# Altium schematic sheet 80_SignalInput.SchDoc
size A3; SheetNumber: 9; SheetTotal: 12
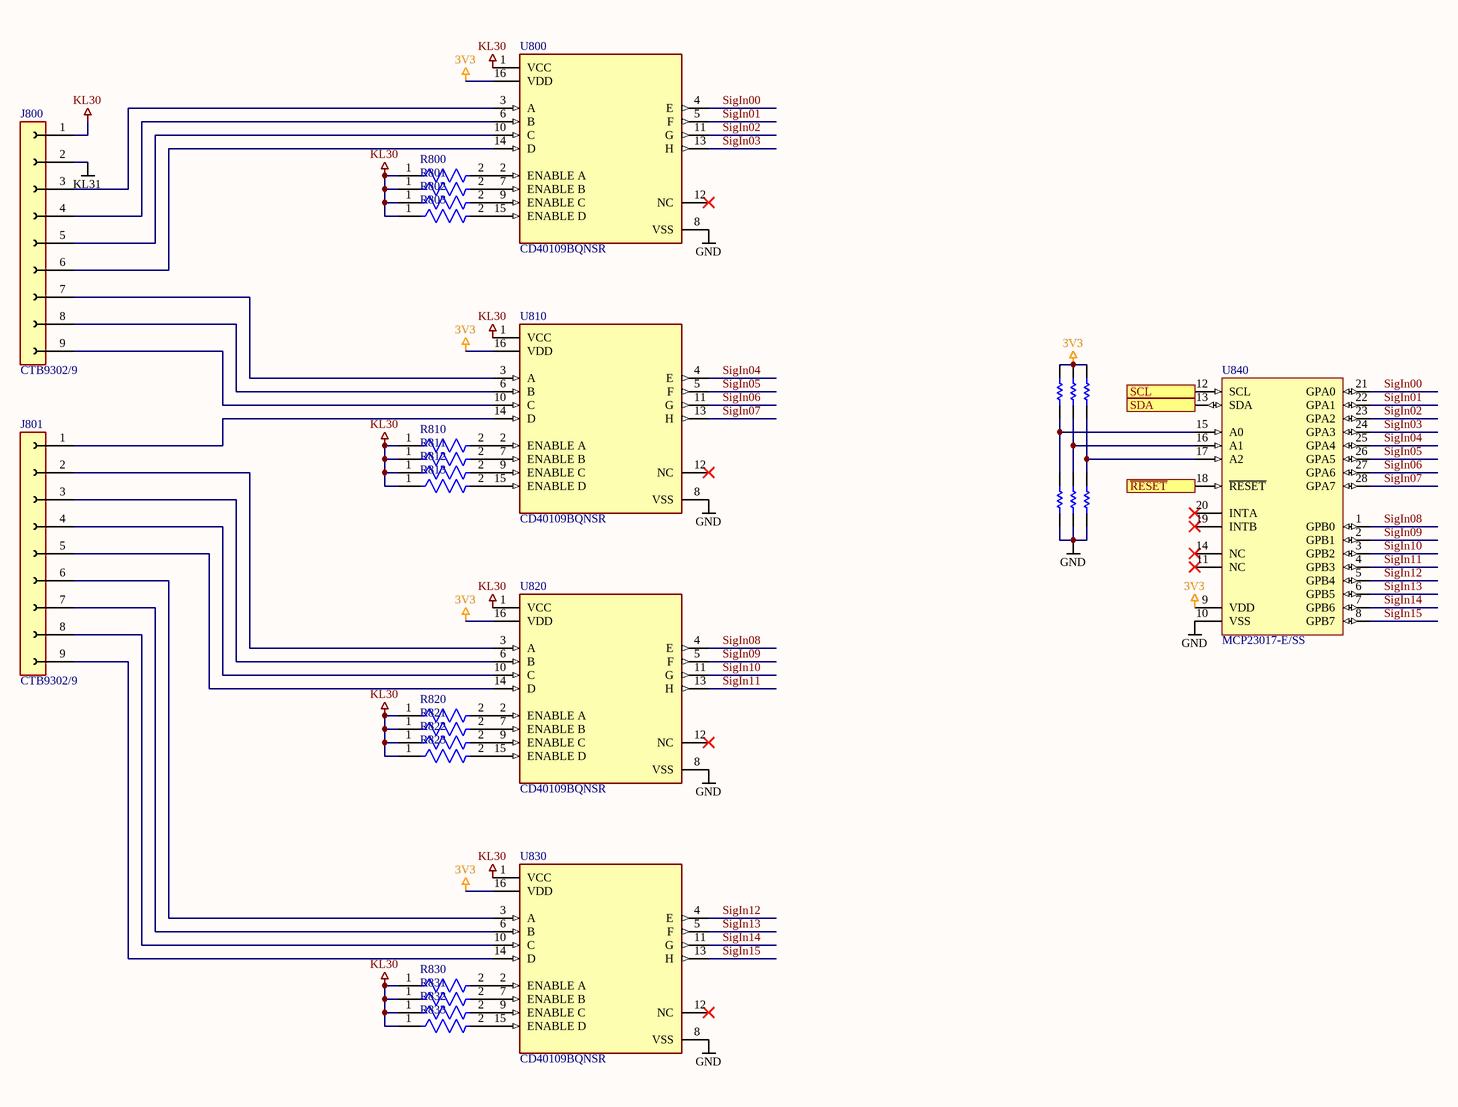
[diagram p0: 80_SignalInput.SchDoc]

## Parts
J800  CTB9302/9  [CTB9302-9]
J801  CTB9302/9  [CTB9302-9]
R800  AC0603FR-071KL  [FP-AC0603-IPC_B]  (value not drawn)
R801  AC0603FR-071KL  [FP-AC0603-IPC_B]  (value not drawn)
R802  AC0603FR-071KL  [FP-AC0603-IPC_B]  (value not drawn)
R803  AC0603FR-071KL  [FP-AC0603-IPC_B]  (value not drawn)
R810  AC0603FR-071KL  [FP-AC0603-IPC_B]  (value not drawn)
R811  AC0603FR-071KL  [FP-AC0603-IPC_B]  (value not drawn)
R812  AC0603FR-071KL  [FP-AC0603-IPC_B]  (value not drawn)
R813  AC0603FR-071KL  [FP-AC0603-IPC_B]  (value not drawn)
R820  AC0603FR-071KL  [FP-AC0603-IPC_B]  (value not drawn)
R821  AC0603FR-071KL  [FP-AC0603-IPC_B]  (value not drawn)
R822  AC0603FR-071KL  [FP-AC0603-IPC_B]  (value not drawn)
R823  AC0603FR-071KL  [FP-AC0603-IPC_B]  (value not drawn)
R830  AC0603FR-071KL  [FP-AC0603-IPC_B]  (value not drawn)
R831  AC0603FR-071KL  [FP-AC0603-IPC_B]  (value not drawn)
R832  AC0603FR-071KL  [FP-AC0603-IPC_B]  (value not drawn)
R833  AC0603FR-071KL  [FP-AC0603-IPC_B]  (value not drawn)
R840  RC0603JR-070RL  [RESC1608X55X25ML10T15]  (value not drawn)
R841  RC0603JR-070RL  [RESC1608X55X25ML10T15]  (value not drawn)
R842  RC0603JR-070RL  [RESC1608X55X25ML10T15]  (value not drawn)
R843  RC0603JR-070RL  [RESC1608X55X25ML10T15]  (value not drawn)
R844  RC0603JR-070RL  [RESC1608X55X25ML10T15]  (value not drawn)
R845  RC0603JR-070RL  [RESC1608X55X25ML10T15]  (value not drawn)
U800  CD40109BQNSR  [FP-NS0016A-IPC_C]
U810  CD40109BQNSR  [FP-NS0016A-IPC_C]
U820  CD40109BQNSR  [FP-NS0016A-IPC_C]
U830  CD40109BQNSR  [FP-NS0016A-IPC_C]
U840  MCP23017-E/SS  [SSOP-SS28_N]

## Ports
SCL (see 1[4C], 2[1C], 6[1C], 12[1B]), SDA (see 1[4C], 2[1C], 6[1C], 12[1B]), ~{RESET} (see 1[4C], 12[2D])

## Nets
3V3: R840.2 R841.2 R842.2 U800.16(VDD) U810.16(VDD) U820.16(VDD) U830.16(VDD) U840.9(VDD)
GND: R843.1 R844.1 R845.1 U800.8(VSS) U810.8(VSS) U820.8(VSS) U830.8(VSS) U840.10(VSS)
KL30: J800.1 R800.1 R801.1 R802.1 R803.1 R810.1 R811.1 R812.1 R813.1 R820.1 R821.1 R822.1 R823.1 R830.1 R831.1 R832.1 R833.1 U800.1(VCC) U810.1(VCC) U820.1(VCC) U830.1(VCC)
KL31: J800.2
~{RESET}: U840.18(~{RESET}) ; port ~{RESET}
SCL: U840.12(SCL) ; port SCL
SDA: U840.13(SDA) ; port SDA
SigIn00: U800.4(E) U840.21(GPA0)
SigIn01: U800.5(F) U840.22(GPA1)
SigIn02: U800.11(G) U840.23(GPA2)
SigIn03: U800.13(H) U840.24(GPA3)
SigIn04: U810.4(E) U840.25(GPA4)
SigIn05: U810.5(F) U840.26(GPA5)
SigIn06: U810.11(G) U840.27(GPA6)
SigIn07: U810.13(H) U840.28(GPA7)
SigIn08: U820.4(E) U840.1(GPB0)
SigIn09: U820.5(F) U840.2(GPB1)
SigIn10: U820.11(G) U840.3(GPB2)
SigIn11: U820.13(H) U840.4(GPB3)
SigIn12: U830.4(E) U840.5(GPB4)
SigIn13: U830.5(F) U840.6(GPB5)
SigIn14: U830.11(G) U840.7(GPB6)
SigIn15: U830.13(H) U840.8(GPB7)
NetJ800_3: J800.3 U800.3(A)
NetJ800_4: J800.4 U800.6(B)
NetJ800_5: J800.5 U800.10(C)
NetJ800_6: J800.6 U800.14(D)
NetJ800_7: J800.7 U810.3(A)
NetJ800_8: J800.8 U810.6(B)
NetJ800_9: J800.9 U810.10(C)
NetJ801_1: J801.1 U810.14(D)
NetJ801_2: J801.2 U820.3(A)
NetJ801_3: J801.3 U820.6(B)
NetJ801_4: J801.4 U820.10(C)
NetJ801_5: J801.5 U820.14(D)
NetJ801_6: J801.6 U830.3(A)
NetJ801_7: J801.7 U830.6(B)
NetJ801_8: J801.8 U830.10(C)
NetJ801_9: J801.9 U830.14(D)
NetR800_2: R800.2 U800.2(ENABLE_A)
NetR801_2: R801.2 U800.7(ENABLE_B)
NetR802_2: R802.2 U800.9(ENABLE_C)
NetR803_2: R803.2 U800.15(ENABLE_D)
NetR810_2: R810.2 U810.2(ENABLE_A)
NetR811_2: R811.2 U810.7(ENABLE_B)
NetR812_2: R812.2 U810.9(ENABLE_C)
NetR813_2: R813.2 U810.15(ENABLE_D)
NetR820_2: R820.2 U820.2(ENABLE_A)
NetR821_2: R821.2 U820.7(ENABLE_B)
NetR822_2: R822.2 U820.9(ENABLE_C)
NetR823_2: R823.2 U820.15(ENABLE_D)
NetR830_2: R830.2 U830.2(ENABLE_A)
NetR831_2: R831.2 U830.7(ENABLE_B)
NetR832_2: R832.2 U830.9(ENABLE_C)
NetR833_2: R833.2 U830.15(ENABLE_D)
NetR840_1: R840.1 R843.2 U840.15(A0)
NetR841_1: R841.1 R844.2 U840.16(A1)
NetR842_1: R842.1 R845.2 U840.17(A2)

Not connected (* = marked no-connect by the designer): U800 12(NC)*; U810 12(NC)*; U820 12(NC)*; U830 12(NC)*; U840 11(NC)* 14(NC)* 19(INTB)* 20(INTA)*

## Library data of the parts
J800 J801 = CTB9302-9: CTB9302/9 - Stiftleiste - 9-pol, RM 5 mm, 0°
R800-R803 R810-R813 R820-R823 R830-R833 = CMP-2000-04828-3: RES 1kΩ 1.00% 0.1W 0603; Voltage Rating: 50V; Power Rating: 100mW; Tolerance: 1%; Temperature Coefficient: 100ppm/°C; Resistance: 1kR; Depth: 0.8mm; Case/Package: 0603; Size Code: 0603; Case Code (Metric): 1608; Height: 0.022inch; Series: AC; Width: 0.031inch; Construction: Rectangular; Length: 0.063inch; Case Code (Imperial): 0603; Package Quantity: 1; RoHS Compliant: Yes; Features: Moisture Resistant; Resistor Type: Thick Film; Max Power Dissipation: 100mW; Packaging: Tape and Reel; Termination: SMD/SMT; Ratings: AEC-Q200; Max Operating Temperature: 155°C; Min Operating Temperature: -55°C; Military Standard: Not; Lead Free: Lead Free; Number of Terminations: 2
R840-R845 = CMP-2100-03667-1: Chip Resistor, 0 Ohm, +/- 5%, 0.1 W, -55 to 155 degC, 0603 (1608 Metric), RoHS, Tape and Reel; Manufacturer: Yageo; Temperature Coefficient: 200ppm/degreesC; Voltage Rating: 50V; Power Rating: 100mW; Resistance: 0mOhm; Width: 0.8mm; Max Operating Temperature: 155degC; Tolerance: 5%; Package Reference: 0603; Height: 0.45mm; Depth: 0.8mm; Package Description: 2-Pin Surface Mount Device, Body 1.6 x 0.8 mm; Termination: SMD/SMT; Package Quantity: 5000; Case/Package: 0603; Case Code (Imperial): 0603; Radiation Hardening: No; Number of Pins: 2; Length: 1.6mm; Lead Free: LeadFree; Voltage Rating (DC): 50V; Military Standard: Not; Datasheet URL: http://www.yageo.com/NewPortal/yageodocoutput?fileName=/pdf/R-Chip/PYu-RC_Group_51_RoHS_L_5.pdf; Manufacturer URL: http://www.yageo.com/; Packaging: TapeandReel; Case Code (Metric): 1608; Min Operating Temperature: -55degC; Composition: ThickFilm; RoHSCompliant: true; Contact Plating: Tin; Datasheet Version: Rev. 5, 10/2016; REACH SVHC: NoSVHC
U800 U810 U820 U830 = CMP-04899-000094-1: IC TRNSLTR UNIDIRECTIONAL 16SO; Max Supply Voltage: 18V; Number of Channels: 4; Propagation Delay: 240ns; High Level Output Current: -4mA; Logic Function: Level Shifter; Turn-On Delay Time: 740ns; Data Rate: 10Mbps; Min Supply Voltage: 3V; Low Level Output Current: 4mA; Quiescent Current: 20uA; Output Type: Voltage; Packaging: Tape and Reel; Mount: Surface Mount; Contact Plating: Gold; Min Operating Temperature: -40°C; Number of Circuits: 4; Lead Free: Lead Free; Max Operating Temperature: 125°C; Radiation Hardening: No; Channel Type: Unidirectional; RoHS Compliant: Yes; Series: 4000B; Package Quantity: 2000; Number of Pins: 16; Technology: CMOS; Case/Package: SOP; Number of Bits: 4
U840 = CMP-0186-00176-2: 16-Bit I/O Expander with Serial Interface, 28-Pin SSOP, Extended Temperature; PackageVersion: revBB, Aug-2009; ComponentLink1Description: Manufacturer URL; ComponentLink3Description: Package Specification; PackageDescription: 28-Lead Plastic Shrink Small Outline (SS) - 5.3mm Body [SSOP]; ComponentLink1URL: http://www.microchip.com/; Code_JEDEC: MS-150; RevisionNote: URLs added.; ComponentLink3URL: http://www.microchip.com/stellent/groups/techpub_sg/documents/packagingspec/en012702.pdf; ComponentLink2URL: http://ww1.microchip.com/downloads/en/DeviceDoc/21952b.pdf; ComponentLink2Description: Datasheet; PackageReference: SSOP-SS28; DatasheetVersion: revB, Feb-2007